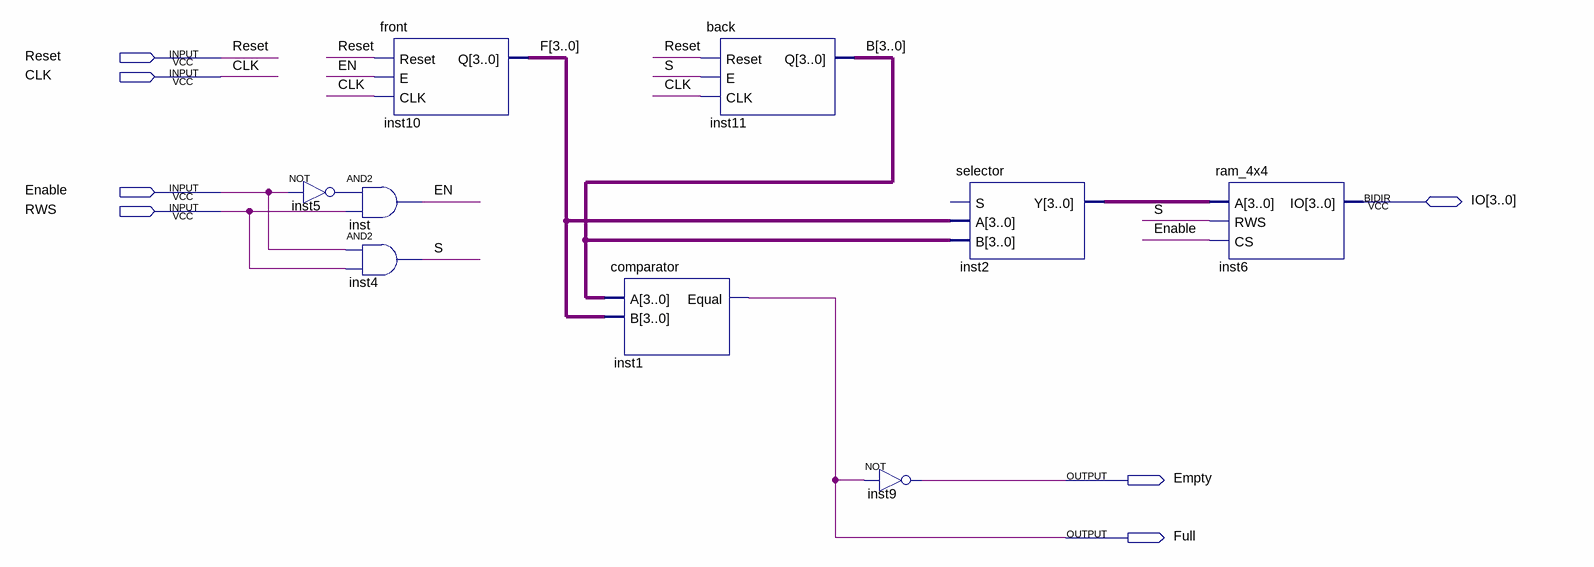
[diagram p0: schematic sheet]
// Quartus schematic queue4x4.bdf as structural Verilog: 9 symbols, 7 pins
module queue4x4 (
  input  Reset,
  input  CLK,
  input  Enable,
  input  RWS,
  inout  [3:0] IO,
  output Empty,
  output Full
);

  wire EN, inst5_out, S;
  wire [3:0] B, F, inst2_y;

  not inst5 (inst5_out, Enable);
  front inst10 (.Reset(Reset), .E(EN), .CLK(CLK), .Q(F));
  and inst (EN, inst5_out, RWS);
  and inst4 (S, Enable, RWS);
  comparator inst1 (.A(B), .B(F), .Equal(Full));
  back inst11 (.Reset(Reset), .E(S), .CLK(CLK), .Q(B));
  not inst9 (Empty, Full);
  selector inst2 (.A(F), .B(B), .Y(inst2_y));  // open: S
  ram_4x4 inst6 (.A(inst2_y), .RWS(S), .CS(Enable), .IO(IO));
endmodule
